# Altium schematic sheet Serial.SchDoc
size A4
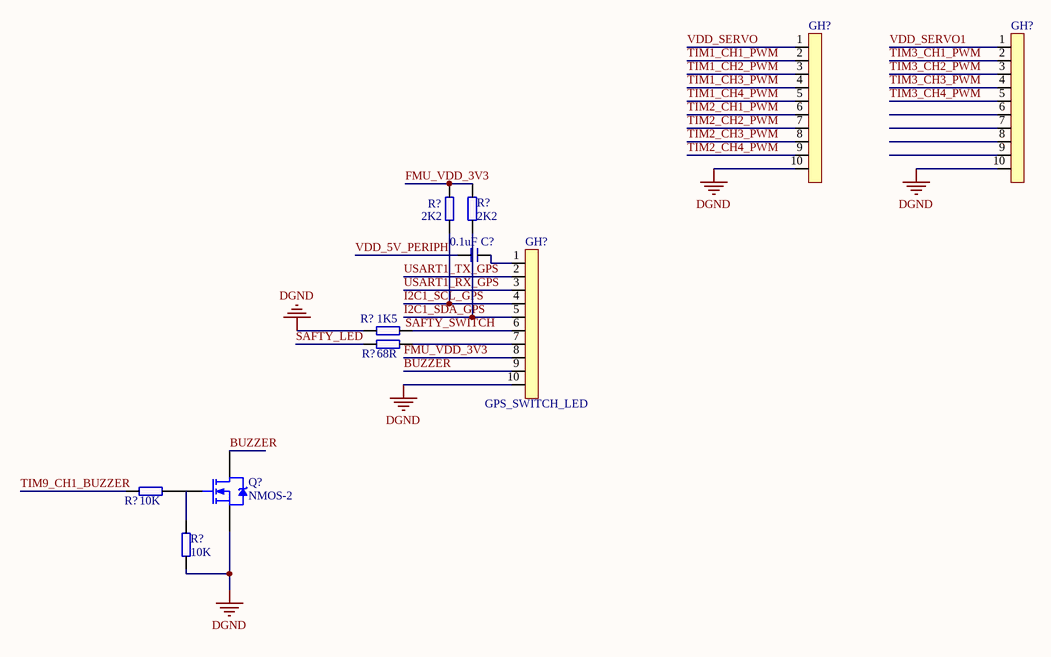
[diagram p0: Serial.SchDoc]

## Parts
(Parts that share a designator on the sheet are numbered #1, #2 ... from top to bottom, then left to right.)
C?  value 0.1uF  [C_0402]  (hidden comment: C_0402)
GH?#1  GH125_li_10p  [GH125_li_10p]  (value not drawn)
GH?#2  GH125_li_10p  [GH125_li_10p]  (value not drawn)
GH?#3  GPS_SWITCH_LED  [GH125_li_10p]
Q?  NMOS-2  [TO-220AB]
R?#1  value 2K2  [R_0402]  (hidden comment: R_0402)
R?#2  value 2K2  [R_0402]  (hidden comment: R_0402)
R?#3  value 1K5  [R_0402]  (hidden comment: R_0402)
R?#4  value 68R  [R_0402]  (hidden comment: R_0402)
R?#5  value 10K  [R_0402]  (hidden comment: R_0402)
R?#6  value 10K  [R_0402]  (hidden comment: R_0402)

## Nets
DGND: GH?#1.10 GH?#2.10 GH?#3.10 Q?.3(S) R?#3.1 R?#6.1
BUZZER: GH?#3.9 Q?.2(D)
FMU_VDD_3V3: GH?#3.8 R?#1.1 R?#2.1
I2C1_SCL_GPS: GH?#3.4 R?#1.2
I2C1_SDA_GPS: GH?#3.5 R?#2.2
SAFTY_LED: R?#4.1
TIM1_CH1_PWM: GH?#1.2
TIM1_CH2_PWM: GH?#1.3
TIM1_CH3_PWM: GH?#1.4
TIM1_CH4_PWM: GH?#1.5
TIM2_CH1_PWM: GH?#1.6
TIM2_CH2_PWM: GH?#1.7
TIM2_CH3_PWM: GH?#1.8
TIM2_CH4_PWM: GH?#1.9
TIM3_CH1_PWM: GH?#2.2
TIM3_CH2_PWM: GH?#2.3
TIM3_CH3_PWM: GH?#2.4
TIM3_CH4_PWM: GH?#2.5
TIM9_CH1_BUZZER: R?#5.1
USART1_RX_GPS: GH?#3.3
USART1_TX_GPS: GH?#3.2
VDD_5V_PERIPH: C?.2
VDD_SERVO: GH?#1.1
VDD_SERVO1: GH?#2.1
NetC?_1: C?.1 GH?#3.1
NetGH?#3_6: GH?#3.6 R?#3.2
NetGH?#3_7: GH?#3.7 R?#4.2
NetQ?_1: Q?.1(G) R?#5.2

Not connected (* = marked no-connect by the designer): GH?#2 6 7 8 9; R?#6 2

## Notes on the sheet
- Labels drawn without touching a wire or pin: SAFTY_SWITCH

## Library data of the parts
C? = C_0402: 电容
GH?#3 = GH125_li_10p
Q? = NMOS-2: N-Channel Power MOSFET; Note: Pin 2 is electrically connected to pin 4.; Published: 8-Jun-2000; LatestRevisionDate: 17-Jul-2002; LatestRevisionNote: Re-released for DXP Platform.; DatasheetVersion: PD-9.814; PackageVersion: Feb-1997; PackageReference: TO-220AB; Publisher: Altium Limited; PackageDescription: TO, Thru-Hole, Vertical, Heatsink Mounted; 3 In-Line Leads; Pitch 2.54 mm; ComponentLink1Description: Manufacturer Link; ComponentLink1URL: http://www.irf.com/
R?#1-R?#6 = R_0402: 电阻